# Altium schematic sheet Car_seesaw.schdoc
size 307 x 219 mm
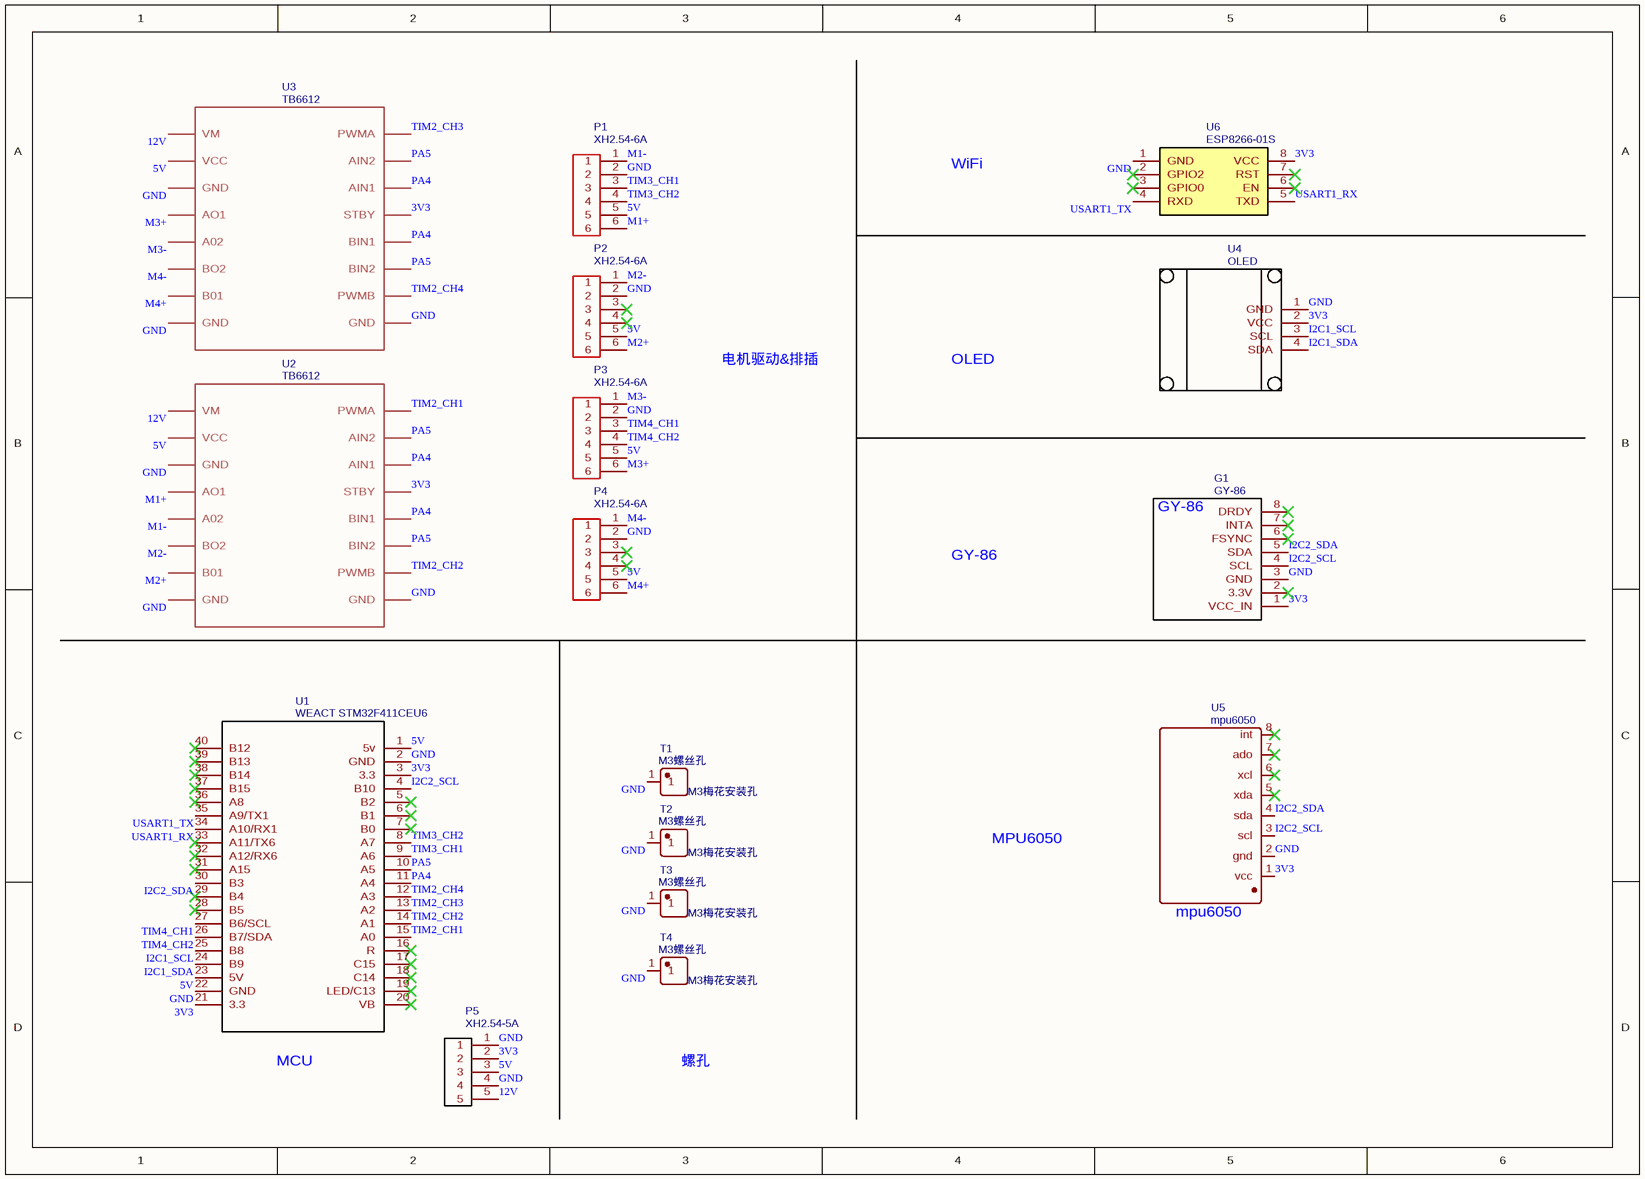
[diagram p0: Car_seesaw.schdoc]

## Parts
G1  GY-86  [GY-86]
P1  XH2.54-6A  [XH2.54-6P]
P2  XH2.54-6A  [XH2.54-6P]
P3  XH2.54-6A  [XH2.54-6P]
P4  XH2.54-6A  [XH2.54-6P]
P5  XH2.54-5A  [XH2.54-5P]
T1  M3螺丝孔  [螺钉孔]
T2  M3螺丝孔  [螺钉孔]
T3  M3螺丝孔  [螺钉孔]
T4  M3螺丝孔  [螺钉孔]
U1  WEACT STM32F411CEU6  [WEACT STM32F411CEU6]
U2  TB6612  [DUAL TB6612FNG]
U3  TB6612  [DUAL TB6612FNG]
U4  OLED  [OLED_0.96_4P_ZJY_NEW]
U5  mpu6050  [MPU6050]
U6  ESP8266-01S  [ESP8266-01S]

## Nets
3V3: G1.1(VCC_IN) P5.2 U1.3(3.3) U1.21(3.3) U2.13(STBY) U3.13(STBY) U4.2(VCC) U5.1(vcc) U6.8(VCC)
5V: P1.5 P2.5 P3.5 P4.5 P5.3 U1.1(5v) U1.23(5V) U2.2(VCC) U3.2(VCC)
12V: P5.5 U2.1(VM) U3.1(VM)
GND: G1.3(GND) P1.2 P2.2 P3.2 P4.2 P5.1 P5.4 T1.1 T2.1 T3.1 T4.1 U1.2(GND) U1.22(GND) U2.3(GND) U2.8(GND) U2.9(GND) U3.3(GND) U3.8(GND) U3.9(GND) U4.1(GND) U5.2(gnd) U6.1(GND)
I2C1_SCL: U1.25(B8) U4.3(SCL)
I2C1_SDA: U1.24(B9) U4.4(SDA)
I2C2_SCL: G1.4(SCL) U1.4(B10) U5.3(scl)
I2C2_SDA: G1.5(SDA) U1.30(B3) U5.4(sda)
M1+: P1.6 U2.4(AO1)
M1-: P1.1 U2.5(A02)
M2+: P2.6 U2.7(B01)
M2-: P2.1 U2.6(BO2)
M3+: P3.6 U3.4(AO1)
M3-: P3.1 U3.5(A02)
M4+: P4.6 U3.7(B01)
M4-: P4.1 U3.6(BO2)
PA4: U1.11(A4) U2.12(BIN1) U2.14(AIN1) U3.12(BIN1) U3.14(AIN1)
PA5: U1.10(A5) U2.11(BIN2) U2.15(AIN2) U3.11(BIN2) U3.15(AIN2)
TIM2_CH1: U1.15(A0) U2.16(PWMA)
TIM2_CH2: U1.14(A1) U2.10(PWMB)
TIM2_CH3: U1.13(A2) U3.16(PWMA)
TIM2_CH4: U1.12(A3) U3.10(PWMB)
TIM3_CH1: P1.3 U1.9(A6)
TIM3_CH2: P1.4 U1.8(A7)
TIM4_CH1: P3.3 U1.27(B6/SCL)
TIM4_CH2: P3.4 U1.26(B7/SDA)
USART1_RX: U1.34(A10/RX1) U6.5(TXD)
USART1_TX: U1.35(A9/TX1) U6.4(RXD)

Not connected (* = marked no-connect by the designer): G1 2(3.3V)* 6(FSYNC)* 7(INTA)* 8(DRDY)*; P2 3* 4*; P4 3* 4*; U1 5(B2)* 6(B1)* 7(B0)* 16(R)* 17(C15)* 18(C14)* 19(LED/C13)* 20(VB)* 28(B5)* 29(B4)* 31(A15)* 32(A12/RX6)* 33(A11/TX6)* 36(A8)* 37(B15)* 38(B14)* 39(B13)* 40(B12)*; U5 5(xda)* 6(xcl)* 7(ado)* 8(int)*; U6 2(GPIO2)* 3(GPIO0)* 6(EN)* 7(RST)*

## Notes on the sheet
- WiFi
- 电机驱动&排插
- OLED
- GY-86
- MPU6050
- (near U1) MCU
- 螺孔
- (in symbol M3螺丝孔) M3梅花安装孔

## Library data of the parts
G1 = GY-86: Contributor: qianlihaoyue; sourceId: cw5FDBzVS; timeStamp: 1453609712; spicePre: G; spiceSymbolName: GY-86
P1-P4 = XH2.54-6A: BOM_Manufacturer: BOOMELE; Contributor: GESHENG1104; BOM_Supplier Part: C33435; BOM_Supplier: LCSC; BOM_Manufacturer Part: XH2.54-6A; image: //image.lceda.cn/szlcsc/C33435.jpg; spicePre: P; spiceSymbolName: XH2.54-6A
P5 = XH2.54-5A: BOM_Manufacturer: BOOMELE; BOM_Manufacturer Part: XH2.54-9A; Contributor: yds432427; BOM_Supplier Part: C33435; BOM_Supplier: LCSC; image: //image.lceda.cn/szlcsc/C33435.jpg; spicePre: P; spiceSymbolName: XH2.54-5A
T1-T4 = M3螺丝孔: Contributor: wowlkh; spicePre: T; spiceSymbolName: M3螺丝孔
U1 = WEACT STM32F411CEU6: Contributor: LShang; BOM_Manufacturer: WEACT; spicePre: U; spiceSymbolName: WEACT STM32F411CEU6
U2 U3 = TB6612: Contributor: crazyy; spicePre: U; spiceSymbolName: TB6612
U4 = OLED: BOM_Manufacturer Part: oled-0.96-4p-i2c; Contributor: paladina; BOM_Supplier Part: undefined; spicePre: U; spiceSymbolName: OLED_0.96_4P_ZJY-1
U5 = mpu6050: Contributor: nodeb; spicePre: U; spiceSymbolName: mpu6050
U6 = ESP8266-01S: Contributor: selloy521; spicePre: U; spiceSymbolName: ESP8266-01S